# EAGLE design Sch_PowerSupply (EAGLE 7.4.0)
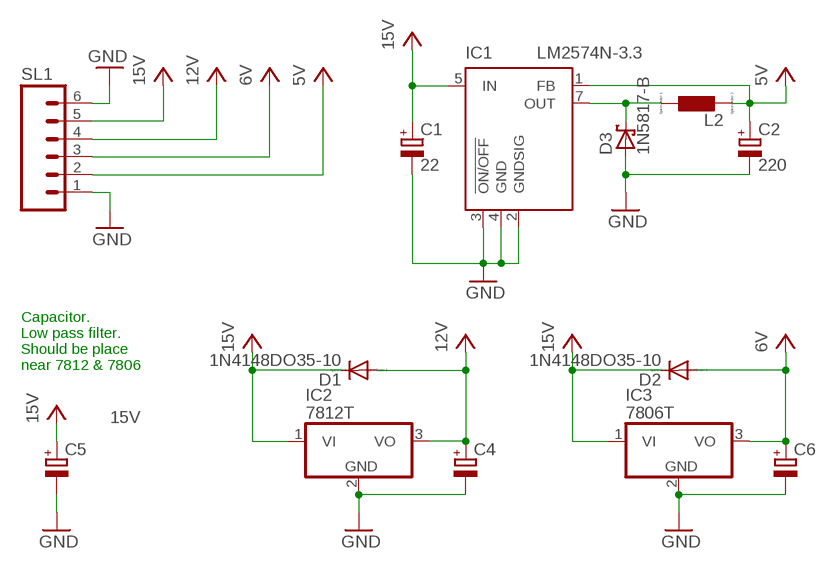
[diagram p0: schematic, sheet 1]

## Parts
C1  22  CPOL-EUE5-8.5  [E5-8,5]
C2  220  CPOL-EUE5-8.5  [E5-8,5]
C4  CPOL-EUE5-8.5  [E5-8,5]
C5  CPOL-EUE5-8.5  [E5-8,5]
C6  CPOL-EUE5-8.5  [E5-8,5]
D1  1N4148DO35-10  [DO35-10]
D2  1N4148DO35-10  [DO35-10]
D3  1N5817-B  [DO41-7.6]
IC1  LM2574N-3.3  [DIL08]
IC2  7812T  [TO220H]
IC3  7806T  [TO220H]
L2  L0204/7  [0204/7]
SL1  M06  [06P]

## Nets
5V: C2.+ IC1.1(FB) L2.2 SL1.2
6V: C6.+ D2.A IC3.3(VO) SL1.3
12V: C4.+ D1.A IC2.3(VO) SL1.4
15V: C1.+ C5.+ D1.C D2.C IC1.5(IN) IC2.1(VI) IC3.1(VI) SL1.5
GND: C1.- C2.- C4.- C5.- C6.- D3.A IC1.2(GNDSIG) IC1.3(!ON/OFF) IC1.4(GND) IC2.2(GND) IC3.2(GND) SL1.1 SL1.6
N$1: D3.C IC1.7(OUT) L2.1

## Notes on the sheet
- Capacitor.
  Low pass filter.
  Should be place 
  near 7812 & 7806

## Library data of the parts
C1 C2 C4-C6 = rcl:CPOL-EU: POLARIZED CAPACITOR, European symbol
D1 D2 = diode:1N4148: DIODE high speed (Philips)
D3 = diode:1N581*: 1.0A SCHOTTKY BARRIER RECTIFIER Source: http://www.diodes.com/datasheets/ds23001.pdf
IC1 = linear:LM2574?-*: SIMPLE SWITCHER 0.5A Step-Down Voltage Regulator Source: http://cache.national.com/ds/LM/LM2574.pdf
IC2 IC3 = linear:78*: Positive VOLTAGE REGULATOR Source: http://cache.national.com/ds/LM/LM78L05.pdf http://www.fairchildsemi.com/ds/LM/LM7805.pdf
L2 = eagle-ltspice:L: INDUCTOR, European symbol; SPICEMODEL: NONE; SPICEPREFIX: L
SL1 = con-amp-quick:M06: AMP QUICK CONNECTOR; OC_FARNELL: unknown; OC_NEWARK: unknown

## Board
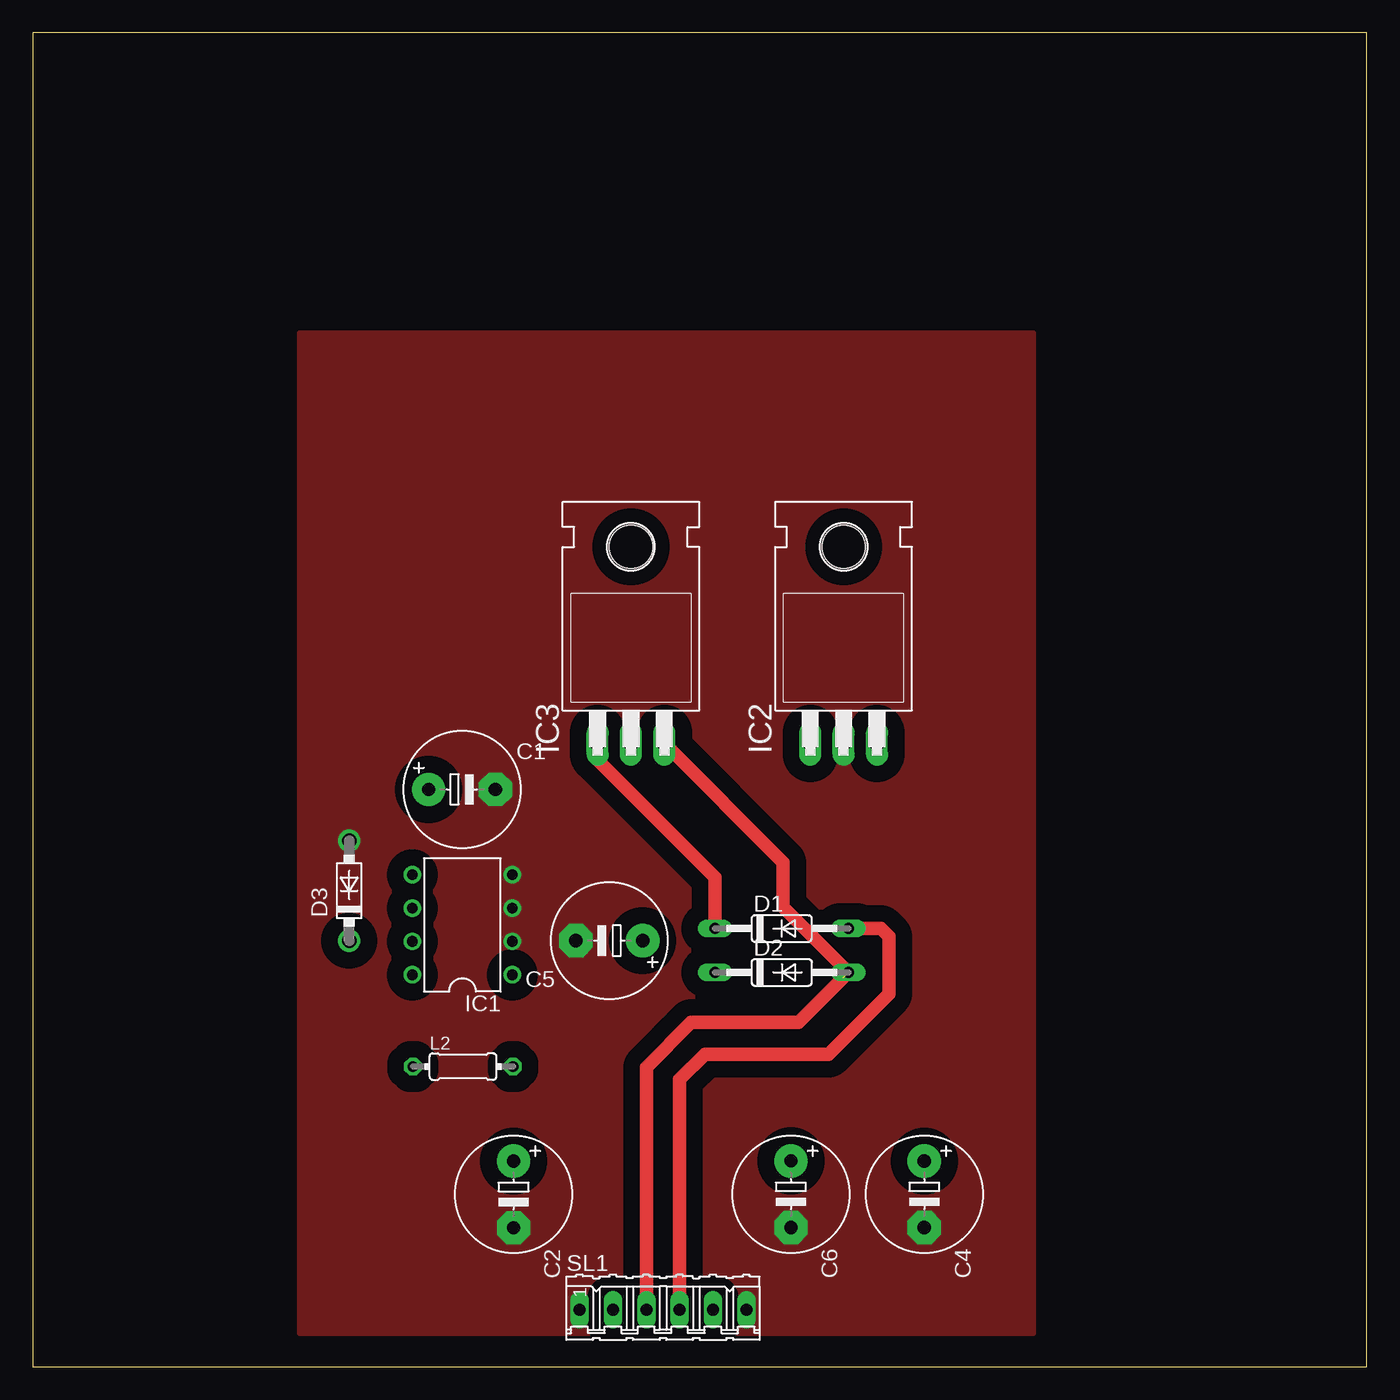
[diagram p1: board, top side]
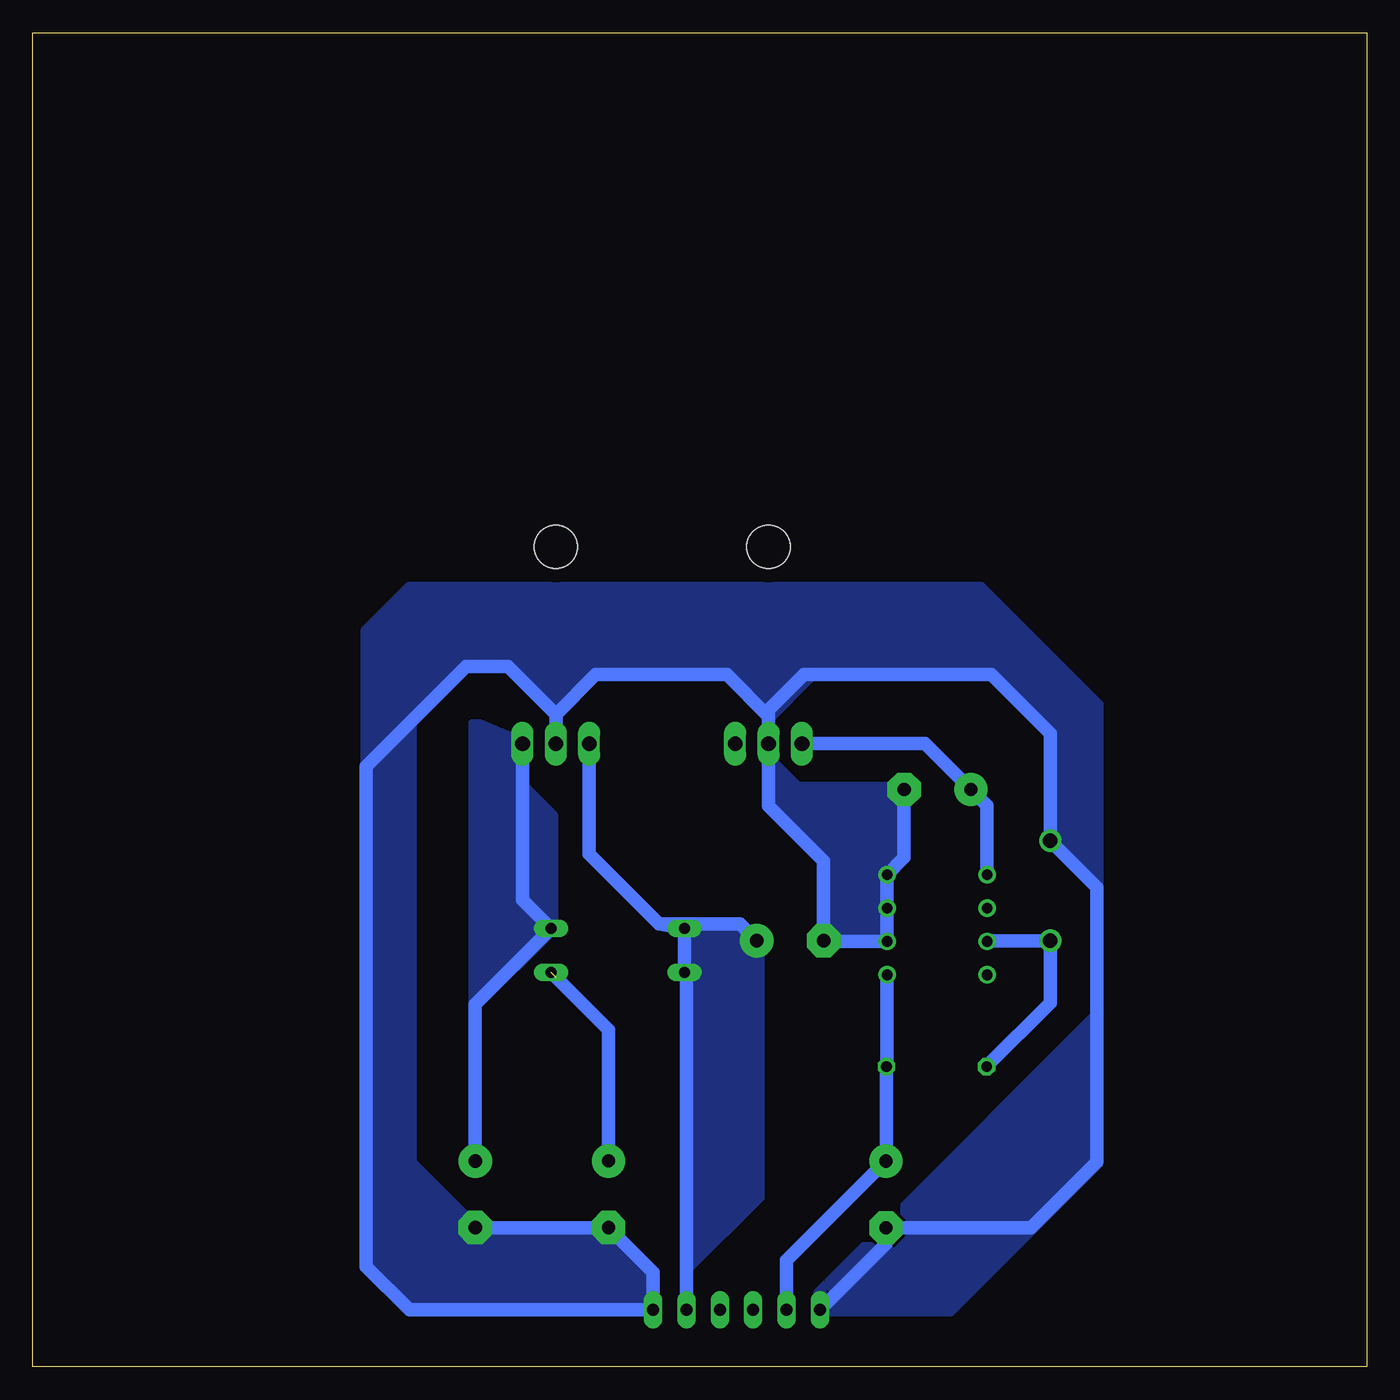
[diagram p2: board, bottom side, seen from below]

Size 101.6 x 101.6 mm. Coordinates in mm from the lower left corner, seen from the top.
Outline: 0,0 101.6,0 101.6,101.6 0,101.6 0,0
Copper layers (1*16): Top 0.035mm / dielectric 1.5mm / Bottom 0.035mm
Design rules "default": minimum track width 10mil, minimum drill 24mil, track to track 8mil, track to pad 8mil, pad to pad 8mil, via to via 8mil, smd to smd 8mil, copper to edge 40mil, drill to drill 8mil, minimum pad ring 10mil, minimum via ring 8mil, stop-mask expansion 4mil, vias tented up to drill 0mil, thermal gap 10mil

### Footprints (pad centres in the part's own frame; a part is rotated, then mirrored left to right if it is on the bottom)
E5-8,5 = drill 1.016 pad 2.54: + -2.54,0 | drill 1.016 pad 2.54 octagon: - 2.54,0
DO35-10 = drill 0.813 long: A 5.08,0; C -5.08,0
DO41-7.6 = drill 1.1 pad 1.7: A 3.81,0; C -3.81,0
DIL08 = drill 0.813 pad 1.27: 1 -3.81,-3.81; 2 -1.27,-3.81; 3 1.27,-3.81; 4 3.81,-3.81; 5 3.81,3.81; 6 1.27,3.81; 7 -1.27,3.81; 8 -3.81,3.81
TO220H = drill 1.118 long: 1 -2.54,-10.16; 2 0,-10.16; 3 2.54,-10.16 | hole 3.302: 0,4.826
0204/7 = drill 0.813 octagon: 1 -3.81,0; 2 3.81,0
06P = drill 0.914 long: 1 -6.35,0; 2 -3.81,0; 3 -1.27,0; 4 1.27,0; 5 3.81,0; 6 6.35,0

### Placement (x,y rotation side)
C1  32.69,43.97 0 top
C2  36.62,13.12 270 top
C4  67.91,13.13 270 top
C5  43.91,32.45 180 top
C6  57.75,13.13 270 top
D1  57.04,33.38 0 top
D2  57.05,30.03 0 top
D3  24.1,36.25 90 top
IC1  32.72,33.66 90 top
IC2  61.76,57.61 0 top
IC3  45.56,57.61 0 top
L2  32.77,22.86 0 top
SL1  48,4.33 0 top

### Tracks (layer width: path | path; a pad name or v marks a point on that pad's centre or on a via)
5V
  Bottom 1.016: SL1.2 44.19,8.09 C2.+ 36.58,15.7 L2.2 36.53,22.9 IC1.1
6V  (1 unrouted)
  Top 1.016: IC3.3 48.11,47.45 57.15,38.42 57.15,35.01 D2.A | SL1.3 46.73,22.8 50.14,26.21 58.31,26.21 61.69,29.6
  Bottom 1.016: C6.+ 57.75,25.65 D2.A
12V
  Top 1.016: D1.A 64.59,33.38 65.2,32.77 65.2,28.4 60.6,23.8 51.18,23.8 49.27,21.89 SL1.4
  Bottom 1.016: C4.+ 67.91,27.59 D1.A 64.3,35.55 IC2.3
  pour Bottom (no thermals): 67.89,27.56 62.1,33.35 62.1,41.96 64.29,44.15 64.29,47.42 64.31,47.45 67.89,48.95
15V
  Top 1.016: IC3.1 43.02,46.2 51.96,37.25 D1.C
  Bottom 1.016: IC3.1 33.63,47.45 C1.+ 28.91,42.73 IC1.5 | IC2.1 59.22,39.05 53.9,33.73 | 53.9,33.73 D1.C D2.C 51.81,29.88 SL1.5 | C5.+ 47.73,33.73 53.9,33.73
  pour Bottom (no thermals): 46.38,32.33 46.38,12.93 51.79,7.52 51.79,33.4 51.69,33.5 47.55,33.5
GND
  Bottom 1.016: C6.- 54.35,7.2 SL1.6 72.91,4.33 76.2,7.62 76.2,45.72 68.58,53.34 65.42,53.34 61.76,49.68 | C6.- | C4.- C6.- | SL1.1 36.62,9.36 C2.- 25.56,10.58 20.55,15.6 20.55,36.52 D3.A 24.1,48.23 28.57,52.7 42.86,52.7 45.56,50.01 45.56,49.53 | 45.56,49.53 IC3.2 45.56,42.7 41.37,38.51 C5.- 41.31,32.39 IC1.2 IC1.3 IC1.4 35.23,38.77 C1.- | IC2.2 61.76,49.68 | 61.76,49.68 58.74,52.7 48.73,52.7 45.56,49.53
  pour Bottom (no thermals): 54.41,4.32 72.75,4.32 76.15,7.72 76.15,55.98 72.85,59.28 72.85,15.52 67.89,10.57 57.78,10.57 54.41,7.19
  pour Bottom: 45.54,49.5 42.52,52.53 42.52,52.78 48.06,52.78 48.44,52.4
  pour Bottom (no thermals): 35.26,44.04 45.42,44.04 45.44,44.02 45.44,42.95 40.79,38.3 40.79,33.15 40.61,32.97 37.21,32.97 36.96,33.22 36.96,37.74 35.51,39.19 35.51,43.79
  pour Bottom (no thermals): 45.57,46.2 45.52,46.2 43.28,43.97 45.44,43.97 45.57,44.09
  pour Top (isolate 1.27, no thermals): 20.32,78.74 20.32,2.54 76.2,2.54 76.2,78.74
  pour Bottom (no thermals): 61.67,49.91 61.72,49.91 65.1,53.29 65.1,53.34
  pour Bottom (no thermals): 76.3,56.21 72.95,59.56 29.34,59.56 20.24,50.47 20.24,36.45 24.05,40.26 24.05,42.98 24.08,43 24.08,48.23 28.55,52.7 58.39,52.7 58.42,52.68 58.78,52.68 61.59,49.86 61.8,49.86 65.25,53.31 68.38,53.31 71.91,49.78 72.9,49.78 76.3,53.19
  pour Bottom: 36.58,10.67 20.57,26.67 20.57,15.49 25.15,10.92 31.75,4.32 41.66,4.32 41.66,5.59
N$1
  Bottom 1.016: L2.1 24.1,27.72 D3.C 28.86,32.44 IC1.7